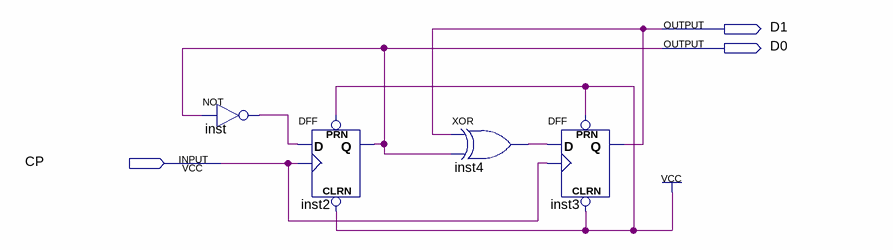
[diagram p0: schematic sheet]
// Quartus schematic State_machine_4.bdf as structural Verilog: 4 symbols, 3 pins
module State_machine_4 (
  input  CP,
  output D1,
  output D0
);

  wire inst4_out, inst_out;

  not inst (inst_out, D0);
  DFF inst2 (.CLRN(1'b1), .CLK(CP), .D(inst_out), .PRN(1'b1), .Q(D0));
  xor inst4 (inst4_out, D1, D0);
  DFF inst3 (.CLRN(1'b1), .CLK(CP), .D(inst4_out), .PRN(1'b1), .Q(D1));
endmodule
